# Altium schematic sheet Camera.SchDoc
size B
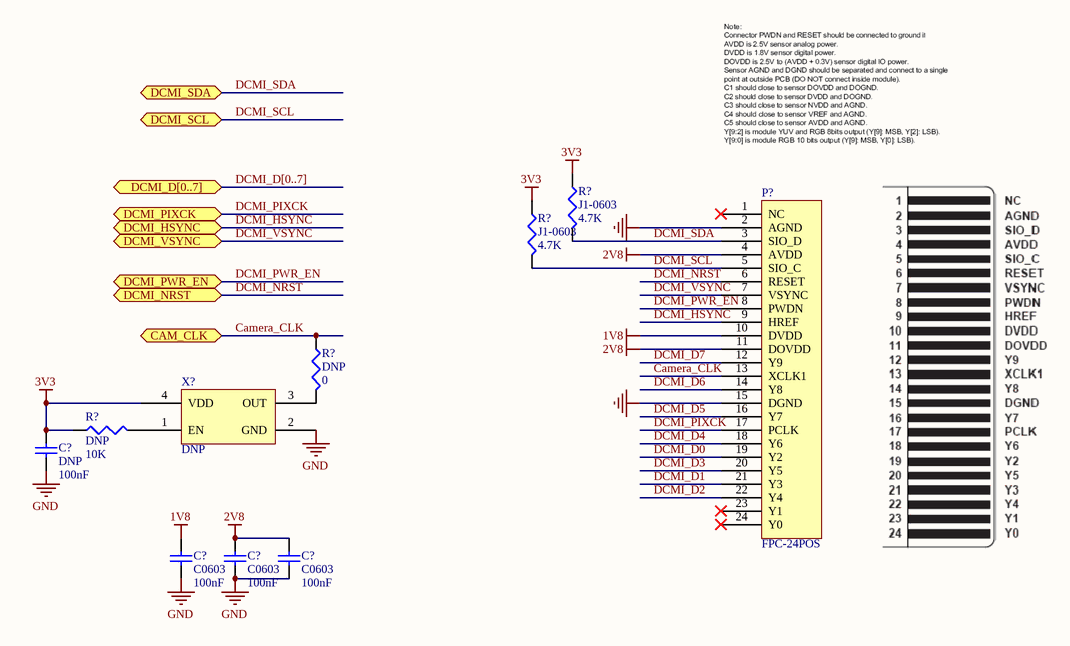
[diagram p0: Camera.SchDoc]

## Parts
(Parts that share a designator on the sheet are numbered #1, #2 ... from top to bottom, then left to right.)
C?#1  DNP  value 100nF  [1608[0603]]
C?#2  C0603  value 100nF  [1608[0603]]
C?#3  C0603  value 100nF  [1608[0603]]
C?#4  C0603  value 100nF  [1608[0603]]
P?  FPC-24POS
R?#1  J1-0603  value 4.7K  [RESC1608X06N]
R?#2  J1-0603  value 4.7K  [RESC1608X06N]
R?#3  DNP  value 0  [RESC1608X06N]
R?#4  DNP  value 10K  [RESC1608X06N]
X?  DNP  [XOSC-5X7]

## Ports
CAM_CLK, DCMI_D[0..7], DCMI_HSYNC, DCMI_NRST, DCMI_PIXCK, DCMI_PWR_EN, DCMI_SCL, DCMI_SDA, DCMI_VSYNC

## Nets
1V8: C?#2.2 P?.10(DVDD)
2V8: C?#3.2 C?#4.2 P?.4(AVDD) P?.11(DOVDD)
3V3: C?#1.2 R?#1.1 R?#2.1 R?#4.1 X?.4(VDD)
GND: C?#1.1 C?#2.1 C?#3.1 C?#4.1 P?.2(AGND) P?.15(DGND) X?.2(GND)
Camera_CLK: P?.13(XCLK1) R?#3.1 ; port CAM_CLK
DCMI_D0: P?.19(Y2)
DCMI_D1: P?.21(Y3)
DCMI_D2: P?.22(Y4)
DCMI_D3: P?.20(Y5)
DCMI_D4: P?.18(Y6)
DCMI_D5: P?.16(Y7)
DCMI_D6: P?.14(Y8)
DCMI_D7: P?.12(Y9)
DCMI_HSYNC: P?.9(HREF) ; port DCMI_HSYNC
DCMI_NRST: P?.6(RESET) ; port DCMI_NRST
DCMI_PIXCK: P?.17(PCLK) ; port DCMI_PIXCK
DCMI_PWR_EN: P?.8(PWDN) ; port DCMI_PWR_EN
DCMI_SCL: P?.5(SIO_C) R?#2.2 ; port DCMI_SCL
DCMI_SDA: P?.3(SIO_D) R?#1.2 ; port DCMI_SDA
DCMI_VSYNC: P?.7(VSYNC) ; port DCMI_VSYNC
NetR?#3_2: R?#3.2 X?.3(OUT)
NetR?#4_2: R?#4.2 X?.1(EN)

Not connected (* = marked no-connect by the designer): P? 1(NC)* 23(Y1)* 24(Y0)*

## Buses and harness runs
bus DCMI_D[0..7] = port DCMI_D[0..7]

## Library data of the parts
C?#1-C?#4 = Cap Semi: Capacitor (Semiconductor SIM Model); Published: 8-Jun-2000; LatestRevisionDate: 29-May-2009; LatestRevisionNote: IPC-7351 Footprint Added.; PackageReference: C0603; Publisher: Altium Limited; PackageDescription: Chip Capacitor
P? = CONN-FPC-24POS: 24POS Flat Printed Circuit (FPC) Connector; Suppler Part Number 1: SFV24R-4STBE1HLF
R?#1-R?#4 = Res3: Resistor; Published: 8-Jun-2000; LatestRevisionDate: 29-May-2009; LatestRevisionNote: IPC-7351 Footprint Added.; PackageReference: J1-0603; Publisher: Altium Limited; PackageDescription: Chip Resistor
X? = OSC_GENERIC: Generic Crystal Oscillator; frequency: *